# EAGLE design A328smd (EAGLE 7.5.0)
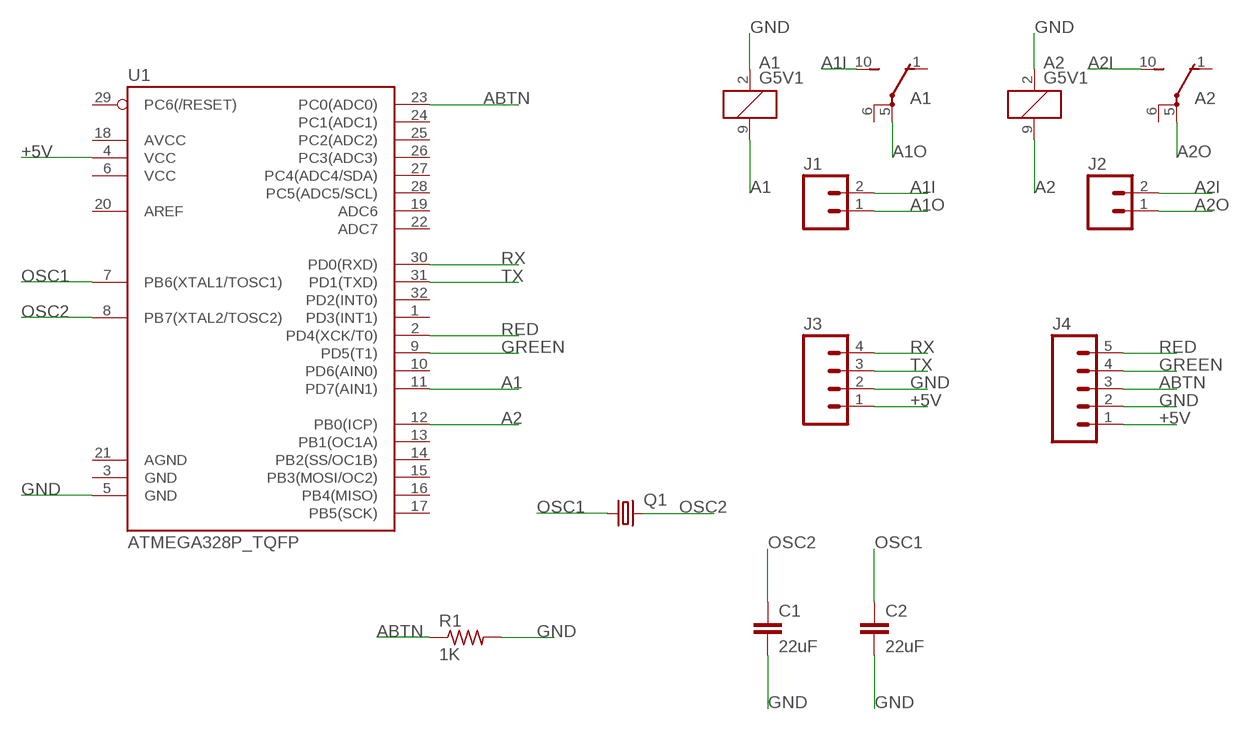
[diagram p0: schematic, sheet 1]

## Parts
A1  G5V1  [G5V1]
A2  G5V1  [G5V1]
C1  22uF  22UF-16V-20%-(1210)  [1210]
C2  22uF  22UF-16V-20%-(1210)  [1210]
J1  M02PTH3  [1X02_LONGPADS]
J2  M02PTH3  [1X02_LONGPADS]
J3  M04NO_SILK_ALL_ROUND  [1X04_NO_SILK_ALL_ROUND]
J4  M05NO_SILK  [1X05_NO_SILK]
Q1  CRYSTALSM49  [SM49]
R1  1K  R-US_M1206  [M1206]
U1  ATMEGA328P_TQFP  [TQFP32-08]

## Nets
+5V: J3.1 J4.1 U1.4(VCC)
A1: A1.9 U1.11(PD7(AIN1))
A1I: A1.10(2:S) J1.2
A1O: A1.5(2:P) J1.1
A2: A2.9 U1.12(PB0(ICP))
A2I: A2.10(2:S) J2.2
A2O: A2.5(2:P) J2.1
ABTN: J4.3 R1.1 U1.23(PC0(ADC0))
GND: A1.2 A2.2 C1.2 C2.2 J3.2 J4.2 R1.2 U1.5(GND)
GREEN: J4.4 U1.9(PD5(T1))
OSC1: C2.1 Q1.1 U1.7(PB6(XTAL1/TOSC1))
OSC2: C1.1 Q1.2 U1.8(PB7(XTAL2/TOSC2))
RED: J4.5 U1.2(PD4(XCK/T0))
RX: J3.4 U1.30(PD0(RXD))
TX: J3.3 U1.31(PD1(TXD))
Unconnected: A1.1(2:O) A1.6(2:P) A2.1(2:O) A2.6(2:P) U1.1(PD3(INT1)) U1.3(GND) U1.6(VCC) U1.10(PD6(AIN0)) U1.13(PB1(OC1A)) U1.14(PB2(SS/OC1B)) U1.15(PB3(MOSI/OC2)) U1.16(PB4(MISO)) U1.17(PB5(SCK)) U1.18(AVCC) U1.19(ADC6) U1.20(AREF) U1.21(AGND) U1.22(ADC7) U1.24(PC1(ADC1)) U1.25(PC2(ADC2)) U1.26(PC3(ADC3)) U1.27(PC4(ADC4/SDA)) U1.28(PC5(ADC5/SCL)) U1.29(PC6(/RESET)) U1.32(PD2(INT0))

## Library data of the parts
A1 A2 = relay:G5V1: RELAY 1 x switch, 0.5 A/125 V AC, 1 A/24 V DC , Omron; MPN: G5V-1-DC24; OC_FARNELL: 9949593; OC_NEWARK: 36M6377
C1 C2 = SparkFun-Capacitors:22UF-16V-20%-(1210): CAP-10381; PROD_ID: CAP-10381
J1 J2 = SparkFun-Connectors:M02: Standard 2-pin 0.1" header. Use with - straight break away headers ( PRT-00116) - right angle break away headers (PRT-00553) - swiss pins (PRT-00743) - machine pins (PRT-00117) - female headers (PRT-00115) Molex polarized connector foot print use with: PRT-08233 with associated crimp pins and housings. 2.54_SCREWTERM for use with PRT-10571. 3.5mm Screw Terminal footprints for PRT-08084 5mm Screw Terminal footprints for use with PRT-08432
J3 = SparkFun-Connectors:M04: Header 4 Standard 4-pin 0.1" header. Use with straight break away headers (SKU : PRT-00116), right angle break away headers (PRT-00553), swiss pins (PRT-00743), machine pins (PRT-00117), and female headers (PRT-00115). Molex polarized connector foot print use with SKU : PRT-08231 with associated crimp pins and housings. 1MM SMD Version SKU: PRT-10208; PROD_ID: CONN-09696
J4 = SparkFun-Connectors:M05: Header 5 Standard 5-pin 0.1" header. Use with straight break away headers (SKU : PRT-00116), right angle break away headers (PRT-00553), swiss pins (PRT-00743), machine pins (PRT-00117), and female headers (PRT-00115). Molex polarized connector foot print use with SKU : PRT-08230 with associated crimp pins and housings.
Q1 = crystal:CRYSTAL: CRYSTAL; OC_FARNELL: unknown; OC_NEWARK: unknown
R1 = resistor:R-US_: RESISTOR, American symbol
U1 = SparkFun-DigitalIC:ATMEGA328P_TQFP; PROD_ID: IC-09069

## Board
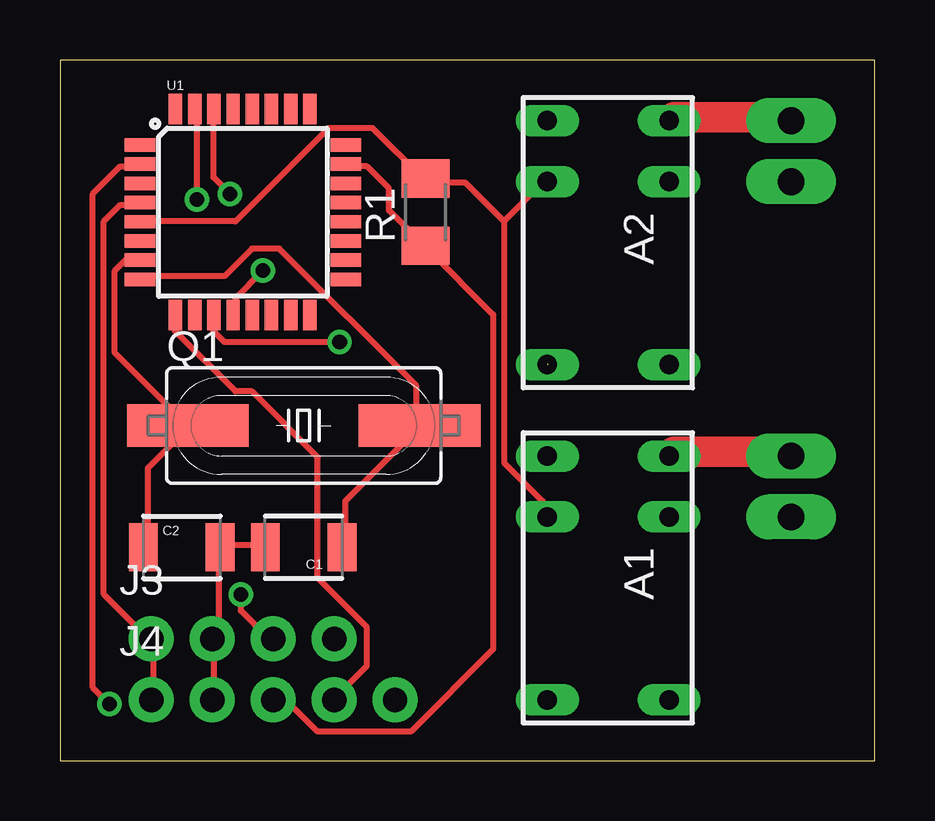
[diagram p1: board, top side]
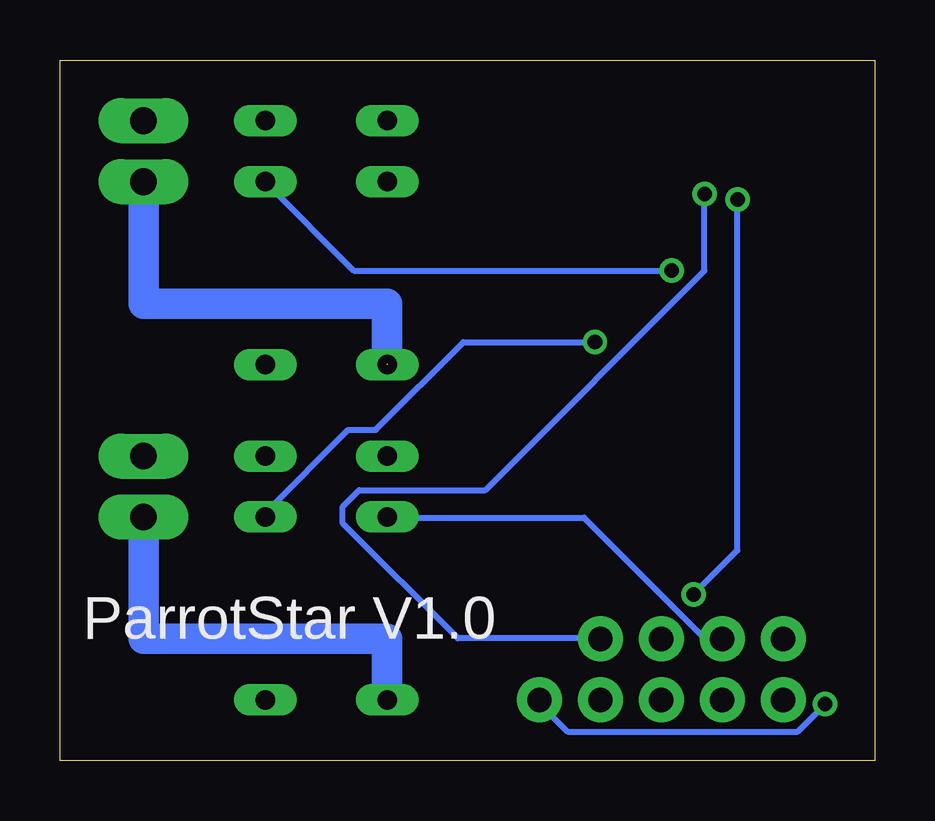
[diagram p2: board, bottom side, seen from below]

Size 33.96 x 29.2 mm. Coordinates in mm from the lower left corner, seen from the top.
Outline: 0,0 33.96,0 33.96,29.2 0,29.2 0,0
Copper layers (1*16): Top 0.035mm / dielectric 1.5mm / Bottom 0.035mm
Design rules "default": minimum track width 10mil, minimum drill 24mil, track to track 8mil, track to pad 8mil, pad to pad 8mil, via to via 8mil, smd to smd 8mil, copper to edge 40mil, drill to drill 8mil, minimum pad ring 10mil, minimum via ring 8mil, stop-mask expansion 4mil, vias tented up to drill 0mil, thermal gap 10mil

### Footprints (pad centres in the part's own frame; a part is rotated, then mirrored left to right if it is on the bottom)
G5V1 = drill 0.813 long: 1 -5.08,-2.54; 2 -2.54,-2.54; 5 5.08,-2.54; 6 5.08,2.54; 9 -2.54,2.54; 10 -5.08,2.54
1210 = smd 1.2 x 2: 1 -1.6,0; 2 1.6,0
1X02_LONGPADS = drill 1.118 pad 1.88 long: 1 0,0; 2 2.54,0
1X04_NO_SILK_ALL_ROUND = drill 1.016 pad 1.88: 1 0,0; 2 2.54,0; 3 5.08,0; 4 7.62,0
1X05_NO_SILK = drill 1.016 pad 1.88: 1 0,0; 2 2.54,0; 3 5.08,0; 4 7.62,0; 5 10.16,0
SM49 = smd 5.08 x 1.778: 1 -4.826,0; 2 4.826,0
M1206 = smd 1.6 x 2: 1 -1.4,0; 2 1.4,0
TQFP32-08 = smd 1.27 x 0.559: 1 -4.293,2.8; 2 -4.293,2; 3 -4.293,1.2; 4 -4.293,0.4; 5 -4.293,-0.4; 6 -4.293,-1.2; 7 -4.293,-2; 8 -4.293,-2.8; 17 4.293,-2.8; 18 4.293,-2; 19 4.293,-1.2; 20 4.293,-0.4; 21 4.293,0.4; 22 4.293,1.2; 23 4.293,2; 24 4.293,2.8 | smd 0.559 x 1.27: 9 -2.8,-4.293; 10 -2,-4.293; 11 -1.2,-4.293; 12 -0.4,-4.293; 13 0.4,-4.293; 14 1.2,-4.293; 15 2,-4.293; 16 2.8,-4.293; 25 2.8,4.293; 26 2,4.293; 27 1.2,4.293; 28 0.4,4.293; 29 -0.4,4.293; 30 -1.2,4.293; 31 -2,4.293; 32 -2.8,4.293

### Placement (x,y rotation side)
A1  22.86,7.62 270 top
A2  22.86,21.59 270 top
C1  10.16,8.89 180 top
C2  5.08,8.89 0 top
J1  30.48,10.16 90 top
J2  30.48,24.13 90 top
J3  3.81,5.08 0 top
J4  3.81,2.54 0 top
Q1  10.16,13.97 0 top
R1  15.24,22.86 90 top
U1  7.62,22.86 0 top

### Tracks (layer width: path | path; a pad name or v marks a point on that pad's centre or on a via)
+5V
  Top 0.254: U1.4 3.2,23.16 2.52,23.16 1.83,22.48 1.83,6.93 3.66,5.1 J3.1 3.89,4.88 3.89,2.59 J4.1
A1  (via drill 0.61)
  Top 0.254: v11.66,17.45 6.86,17.45 6.4,17.91 6.4,18.36 U1.11
  Bottom 0.254: v11.66,17.45 17.14,17.45 20.8,13.79 21.95,13.79 25.38,10.36 A1.9
A1I
  Top 0.254: 25.6,12.88 A1.10 | 30.4,12.88 J1.2
  Top 1.27: 30.4,12.88 25.6,12.88
A1O
  Bottom 1.27: A1.5 20.32,5.08 30.48,5.08 J1.1
A2  (via drill 0.61)
  Top 0.254: v8.46,20.42 7.32,19.28 7.32,18.59 U1.12
  Bottom 0.254: v8.46,20.42 21.72,20.42 25.38,24.08 A2.9
A2I
  Top 0.254: 25.6,26.82 A2.10 | 30.4,26.82 J2.2
  Top 1.27: 30.4,26.82 25.6,26.82
A2O  (1 unrouted)
  Bottom 0.254: 20.34,16.53 20.32,16.53
  Bottom 1.27: 20.32,16.53 20.32,19.05 30.48,19.05 J2.1
ABTN
  Top 0.254: U1.23 12.12,24.77 12.8,24.77 13.72,23.85 13.72,22.94 15.09,21.56 R1.1 15.32,21.34 18.06,18.59 18.06,4.65 14.63,1.22 10.74,1.22 9.6,2.36 8.91,2.36 J4.3
GND
  Top 0.254: U1.5 3.43,22.48 7.32,22.48 11.2,26.36 13.03,26.36 15.09,24.31 R1.2 15.32,24.08 16.92,24.08 18.52,22.48 | C1.2 8.46,8.99 6.86,8.99 C2.2 6.63,8.76 6.63,5.33 6.4,5.1 J3.2 6.4,4.88 6.4,2.59 J4.2 | 18.52,22.48 18.52,12.42 20.12,10.82 20.12,10.36 A1.2 | 18.52,22.48 20.12,24.08 A2.2
  Bottom 0.254: J3.2 6.4,5.1 7.09,5.1 12.12,10.13 20.12,10.13 A1.2
GREEN
  Top 0.254: U1.9 4.8,18.36 4.8,17.91 7.32,15.39 8,15.39 10.74,12.65 10.74,7.62 12.8,5.56 12.8,3.96 11.43,2.59 J4.4
OSC1
  Top 0.254: U1.7 3.2,20.88 2.74,20.88 2.29,20.42 2.29,16.99 5.26,14.02 Q1.1 5.26,13.79 3.66,12.19 3.66,8.99 C2.1
OSC2
  Top 0.254: U1.8 3.43,20.19 6.86,20.19 8,21.34 9.14,21.34 14.86,15.62 14.86,14.02 Q1.2 14.86,13.79 11.89,10.82 11.89,8.99 C1.1
RED  (via drill 0.61)
  Top 0.254: v2.06,2.36 1.37,3.05 1.37,23.62 2.52,24.77 3.2,24.77 U1.2
  Bottom 0.254: v2.06,2.36 3.2,1.22 12.8,1.22 13.95,2.36 J4.5
RX  (via drill 0.61)
  Top 0.254: v7.09,23.62 6.4,24.31 6.4,27.05 U1.30
  Bottom 0.254: v7.09,23.62 7.09,20.42 16.23,11.28 21.49,11.28 22.17,10.59 22.17,9.91 17.37,5.1 11.43,5.1 J3.4
TX  (via drill 0.61)
  Top 0.254: v5.71,23.39 5.71,27.05 U1.31 | v7.54,6.93 7.54,6.25 8.69,5.1 J3.3
  Bottom 0.254: v5.71,23.39 5.71,8.76 v7.54,6.93

### Text on the board
bNames: ParrotStar V1.0